# EAGLE design Nomi's_Smart_Socket_V1 (EAGLE 9.3.0)
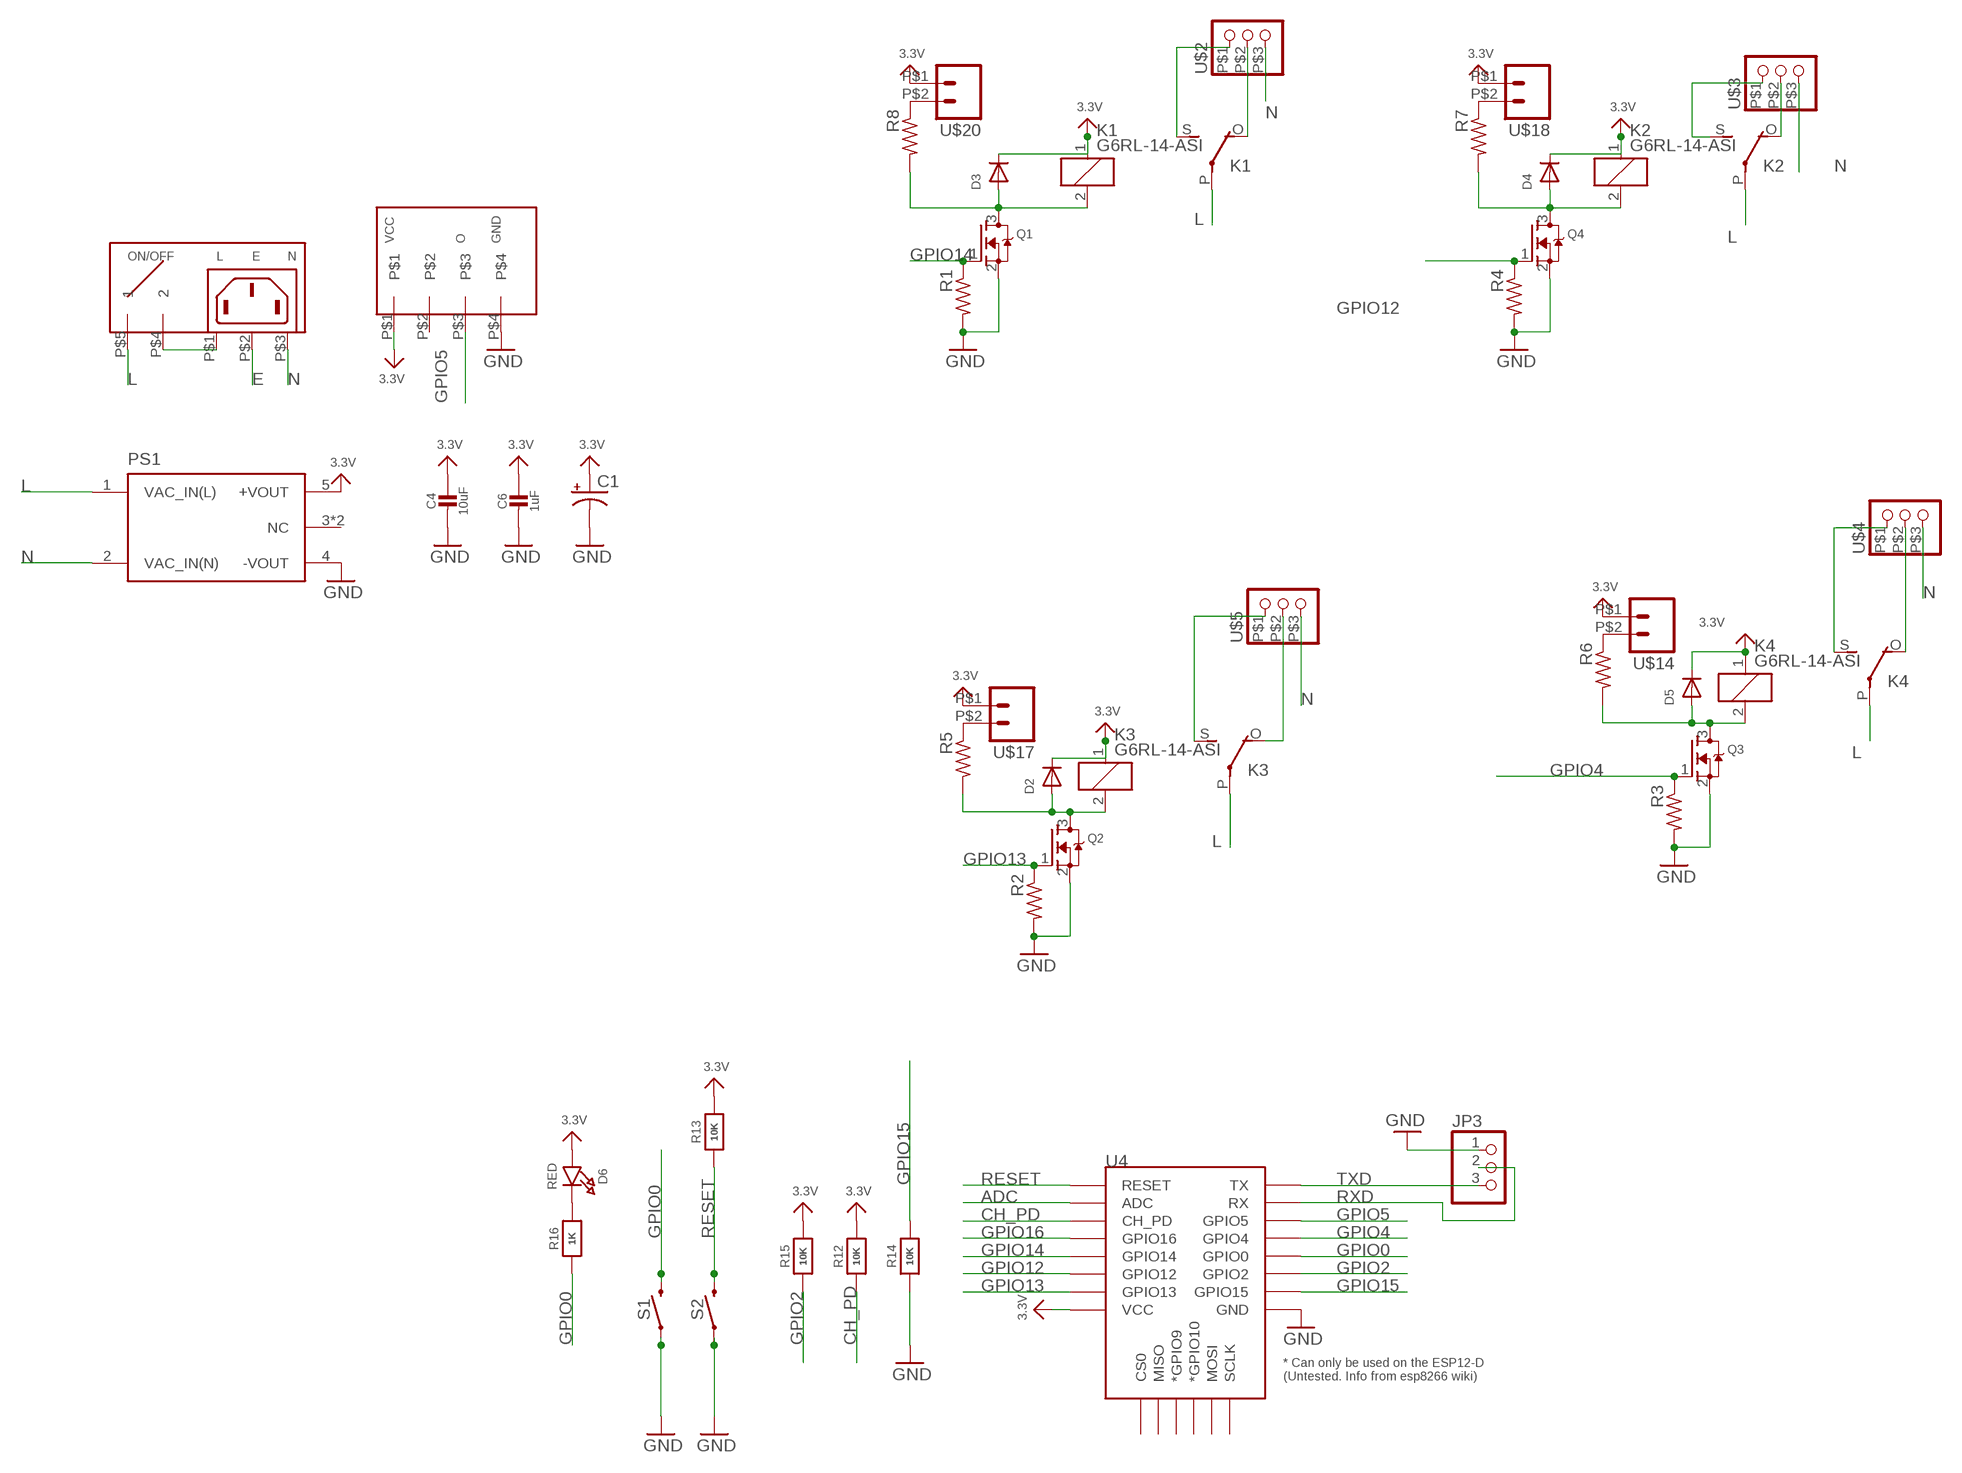
[diagram p0: schematic, sheet 1]

## Parts
C1  CPOL-USE5-10.5  [E5-10,5]
C4  10uF  CAP_CERAMIC_0805  [_0805]
C6  1uF  CAP_CERAMIC_0603  [_0603]
D2  DIODE_SOD-123FL  [SOD-123FL]
D3  DIODE_SOD-123FL  [SOD-123FL]
D4  DIODE_SOD-123FL  [SOD-123FL]
D5  DIODE_SOD-123FL  [SOD-123FL]
D6  RED  LED0805_NOOUTLINE  [CHIPLED_0805_NOOUTLINE]
JP3  PINHD-1X3  [1X03]
K1  G6RL-14-ASI  [G6RW]
K2  G6RL-14-ASI  [G6RW]
K3  G6RL-14-ASI  [G6RW]
K4  G6RL-14-ASI  [G6RW]
PS1  RAC04-3.3SGBRAC04-3.3SGB-3D  [DIP1778W80P508L3670H1500Q6B]
Q1  MOSFET-NREFLOW  [SOT23]
Q2  MOSFET-NREFLOW  [SOT23]
Q3  MOSFET-NREFLOW  [SOT23]
Q4  MOSFET-NREFLOW  [SOT23]
R1  10k  R-US_R0603  [R0603]
R2  10k  R-US_R0603  [R0603]
R3  10k  R-US_R0603  [R0603]
R4  10k  R-US_R0603  [R0603]
R5  22  R-US_R0603  [R0603]
R6  22  R-US_R0603  [R0603]
R7  22  R-US_R0603  [R0603]
R8  22  R-US_R0603  [R0603]
R12  10K  RESISTOR_0603  [_0603]
R13  10K  RESISTOR_0603  [_0603]
R14  10K  RESISTOR_0603  [_0603]
R15  10K  RESISTOR_0603  [_0603]
R16  1K  RESISTOR_0603  [_0603]
S1  MOMENTARY-SWITCH-SPST-SMD-4.6X2.8MM  [TACTILE_SWITCH_SMD_4.6X2.8MM]
S2  MOMENTARY-SWITCH-SPST-SMD-4.6X2.8MM  [TACTILE_SWITCH_SMD_4.6X2.8MM]
U4  ESP12FSMD  [ESP12F]
U$1  AC-CONN-WITH-SWITCH  [AC-CONN-WITH-SWITCH]
U$2  TERM-BLOCK-3POS-5MM5MM  [TERM-BLOCK-3POS-5MM]
U$3  TERM-BLOCK-3POS-5MM5MM  [TERM-BLOCK-3POS-5MM]
U$4  TERM-BLOCK-3POS-5MM5MM  [TERM-BLOCK-3POS-5MM]
U$5  TERM-BLOCK-3POS-5MM5MM  [TERM-BLOCK-3POS-5MM]
U$13  DHT22  [DHT22]
U$14  TERMINAL-BLOCK-2POS-2.54MM  [TERMINAL-BLOCK-2POS-2.54MM]
U$17  TERMINAL-BLOCK-2POS-2.54MM  [TERMINAL-BLOCK-2POS-2.54MM]
U$18  TERMINAL-BLOCK-2POS-2.54MM  [TERMINAL-BLOCK-2POS-2.54MM]
U$20  TERMINAL-BLOCK-2POS-2.54MM  [TERMINAL-BLOCK-2POS-2.54MM]

## Nets
3.3V: C1.+ C4.1 C6.1 D2.C D3.C D4.C D5.C D6.A K1.1 K2.1 K3.1 K4.1 PS1.5(+VOUT) R12.2 R13.2 R15.2 U4.3.3V(VCC) U$13.P$1 U$14.P$1 U$17.P$1 U$18.P$1 U$20.P$1
ADC: U4.ADC
CH_PD: R12.1 U4.EN(CH_PD)
E: U$1.P$2(EARTH)
GND: C1.- C4.2 C6.2 JP3.1 PS1.4(-VOUT) Q1.2(S) Q2.2(S) Q3.2(S) Q4.2(S) R1.2 R2.2 R3.2 R4.2 R14.1 S1.1 S1.2 S2.1 S2.2 U4.GND U$13.P$4
GPIO0: R16.1 S1.3 S1.4 U4.GPIO0
GPIO2: R15.1 U4.GPIO2
GPIO4: Q3.1(G) R3.1 U4.GPIO4
GPIO5: U4.GPIO5 U$13.P$3
GPIO12: Q4.1(G) R4.1 U4.GPIO12
GPIO13: Q2.1(G) R2.1 U4.GPIO13
GPIO14: Q1.1(G) R1.1 U4.GPIO14
GPIO15: R14.2 U4.GPIO15
GPIO16: U4.GPIO16
L: K1.P(2:P) K2.P(2:P) K3.P(2:P) K4.P(2:P) PS1.1(VAC_IN(L)) U$1.P$5
N: PS1.2(VAC_IN(N)) U$1.P$3(N) U$2.P$3 U$3.P$3 U$4.P$3 U$5.P$3
N$1: U$1.P$1(L) U$1.P$4
N$2: D5.A K4.2 Q3.3(D) R6.2
N$3: D2.A K3.2 Q2.3(D) R5.2
N$4: D3.A K1.2 Q1.3(D) R8.2
N$5: D6.C R16.2
N$6: D4.A K2.2 Q4.3(D) R7.2
N$7: K4.O(2:O) U$4.P$2
N$8: K2.O(2:O) U$3.P$2
N$9: R5.1 U$17.P$2
N$10: R6.1 U$14.P$2
N$11: R7.1 U$18.P$2
N$12: R8.1 U$20.P$2
N$13: K4.S(2:S) U$4.P$1
N$14: K3.O(2:O) U$5.P$2
N$15: K1.S(2:S) U$2.P$1
N$16: K1.O(2:O) U$2.P$2
N$17: K2.S(2:S) U$3.P$1
N$18: K3.S(2:S) U$5.P$1
RESET: R13.1 S2.3 S2.4 U4.RST(RESET)
RXD: JP3.2 U4.RXD(RX)
TXD: JP3.3 U4.TXD(TX)
Unconnected: PS1.3(NC) PS1.6(NC) U4.CLK(SCLK) U4.CS0 U4.GPIO9(*GPIO9) U4.GPIO10(*GPIO10) U4.MISO U4.MOSI U$13.P$2

## Library data of the parts
C1 = adafruit:CPOL-US: POLARIZED CAPACITOR, American symbol
C4 C6 = microbuilder:CAP_CERAMIC: Ceramic Capacitors For new designs, use the packages preceded by an '_' character since they are more reliable: The following footprints should be used on most boards: _0402 - Standard footprint for regular board layouts _0603 - Standard footprint for regular board layouts _0805 - Standard footprint for regular board layouts _1206 - Standard footprint for regular board layouts For extremely tight-pitch boards where space is at a premium, the following 'micro-pitch' footprints can be used (smaller pads, no silkscreen outline, etc.): _0402MP - Micro-pitch footprint for very dense/compact boards _0603MP - Micro-pitch footprint for very dense/compact boards _0805MP - Micro-pitch footprint for very dense/compact boards _1206MP - Micro-pitch footprint for very dense/compact boards
D2-D5 = adafruit:DIODE: Diode SMADIODE - SMA Surface Mount Package 20V 1A Schottky Diode Digikey: 641-1014-6-ND DO-1N4148 - Through Hole Small Current Diode SOD-123 20V 1 A (.5mV Vf) Schottky Diode - Digikey: MBRX120TPMSCT-ND SOD-323 10V 570mA (.38mV Vf, 3ns) Schottky Diode - Digikey: ZLLS410CT-ND SOD-523 30V 30mA Schottky Diode (RB751S-40TE61) - Digikey: RB751S-40TE61CT-ND SOT23-R/W - SOT23 Package (R = Solder Paste/Reflow Ovens, W = Hand-Soldering) BAT54Film 40V 300mA - Digikey: 497-7162-1-ND
D6 = microbuilder:LED: LED 0603 - 0603 Surface Mount Package 2mA: Green LED - Low Power (3.9mcd, 2ma, 1.7Vf) - Digikey: 475-2709-2-ND Orange LED - Low Power (9.8mcd, 2ma, 1.8Vf) - Digikey: 475-1194-2-ND Red LED - Low Power (5mcd, 2ma, 1.8Vf) - Digikey: 475-1195-2-ND Yellow LED - Low Power (7mcd, 2ma, 1.8Vf) - Digikey: 475-1196-2-ND 5mA: Blue LED - Low Power (17mcd, 5ma, 2.9Vf) - Digikey: LNJ937W8CRACT-ND 0805 - 0805 Surface Mount Package 2mA: Red LED (8.8mcd, 2mA, 1.8Vf, Clear) - Low Power [Digikey: 475-2510-1-ND] Green LED (5mcd, 2mA, 1.8Vf, Clear) - Low Power [Digikey: 475-2730-1-ND] Yellow LED (11.3mcd, 2mA, 1.8Vf, Clear) - Low Power [Digikey: 475-2555-1-ND] 20mA: Red LED (104mcd, 20mA, Diffused) - LS R976 [Digikey: 475-1278-6-ND] Red LED (12mcd, 20mA, 2.0Vf, Clear) - APT2012EC [Digikey: 754-1128-1-ND] Green LED (15mcd, 20mA, 2.2Vf, Clear) - APT2012GC [Digikey: 754-1131-1-ND] Orange LED (160mcd, 20mA, 2.1Vf, Clear) - APT2012SECK [Digikey: 754-1130-1-ND] 1206 - 1206 Surface Mount Package Green LED (26mcd, 20mA, Diffused) - LG N971 [Digikey: 475-1407-6-ND] Red LED (15mcd, 20mA, Diffused) - LH N974 [Digikey: 475-1416-6-ND] Cree - Cree High-Power Surface Mount LEDs XPEBWT-L1-0000-00D50 - White 111lm 350mA 2.9Vf 6200K 110° XTEAWT-00-0000-00000LEE3 - White 114lm 350mA 2.85Vf 5000K 115° Everlight - Everlight 45-21 Series Surface Mount LEDs 45-21/QK2C-B2832AC2CB2/2T - Warm White 2000mcd 20mA 3.25Vf 3050K 120° 45-21/LK2C-B38452C4CB2/2T - Nuetral White 2000mcd 20mA 3.25Vf 4150K 120° 45-21/LK2C-B50634C6CB2/2T - Cold White 2200mcd 20mA 3.25Vf 5650K 120° PLCC2 Reverse Mount LS T77K-J1L2-1-0-2-R18-Z - Red 11.25mcd 2mA 1.8Vf 630nm 120° LO T77K-L1M2-24-Z - Orange 19.6mcd 2mA 1.8Vf 606nm 120° LY T77K-K2M1-26-Z - Yellow 15.7mcd 2mA 1.8Vf 587nm 120°
JP3 = pinhead:PINHD-1X3: PIN HEADER
K1-K4 = LinkDesign:G6RL-14-ASI: RELAY 1 x switch, Omron; OC_FARNELL: unknown; OC_NEWARK: unknown
PS1 = LinkDesign:RAC04-3.3SGB: AC/DC Converter, 4 Watt, Single Output, EMC Class B
Q1-Q4 = adafruit:MOSFET-N: N-Channel Mosfet 2N7002E - 60V 260mA SOT23 [Digikey: 2N7002ET1GOSTR-ND] - REEL BSH103 - 30V 850mA SOT23 [Digikey: 568-5013-1-ND]
R1-R8 = adafruit:R-US_: RESISTOR, American symbol
R12-R16 = microbuilder:RESISTOR: Resistors For new designs, use the packages preceded by an '_' character since they are more reliable: The following footprints should be used on most boards: _0402 - Standard footprint for regular board layouts _0603 - Standard footprint for regular board layouts _0805 - Standard footprint for regular board layouts _1206 - Standard footprint for regular board layouts For extremely tight-pitch boards where space is at a premium, the following 'micro-pitch' footprints can be used (smaller pads, no silkscreen outline, etc.): _0402MP - Micro-pitch footprint for very dense/compact boards _0603MP - Micro-pitch footprint for very dense/compact boards _0805MP - Micro-pitch footprint for very dense/compact boards _1206MP - Micro-pitch footprint for very dense/compact boards
S1 S2 = SparkFun-Switches:MOMENTARY-SWITCH-SPST: Momentary Switch (Pushbutton) - SPST Normally-open (NO) SPST momentary switches (buttons, pushbuttons). Variants PTH-12MM - 12mm square, through-hole Momentary Pushbutton Switch - 12mm Square <https://www.sparkfun.com/products/9190> (COM-09190) PTH-6.0MM, PTH-6.0MM-KIT - 6.0mm square, through-hole Mini Pushbutton Switch <https://www.sparkfun.com/products/97> (COM-00097) KIT package intended for soldering kit's - only one side of pads' copper is exposed. PTH-RIGHT-ANGLE-KIT - Right-angle, through-hole Right Angle Tactile Button <https://www.sparkfun.com/products/10791> - Used on SparkFun BigTime Watch Kit <https://www.sparkfun.com/products/11734> SMD-12MM - 12mm square, surface-mount Tactile Button - SMD (12mm) <https://www.sparkfun.com/products/12993> (COM-12993) Used on SparkFun PicoBoard <https://www.sparkfun.com/products/11888> SMD-4.5MM - 4.5mm Square Trackball Switch Used on SparkFun Blackberry Trackballer Breakout <https://www.sparkfun.com/products/13169> SMD-4.6MMX2.8MM - 4.60mm x 2.80mm, surface mount Used on SparkFun SAMD21 Mini Breakout <https://www.sparkfun.com/products/13664> SMD-5.2MM, SMD-5.2-REDUNDANT - 5.2mm square, surface-mount Mini Pushbutton Switch - SMD <https://www.sparkfun.com/products/8720> (COM-08720) Used on Arduino Pro Mini <https://www.sparkfun.com/products/11114> REDUNDANT package connects both switch circuits together SMD-6.0X3.5MM - 6.0 x 3.5mm, surface mount Momentary Reset Switch SMD <https://www.sparkfun.com/products/8229> (COM-08229) SMD-6.2MM-TALL - 6.2mm square, surface mount Tactile Button - SMD (6mm) <https://www.sparkfun.com/products/12992> Used on SparkFun Digital Sandbox <https://www.sparkfun.com/products/12651> SMD-RIGHT-ANGLE - Right-angle, surface mount Used on SparkFun Block for Intel® Edison - Arduino <https://www.sparkfun.com/products/13036>; PROD_ID: SWCH-13065
U4 = noman:ESP12F: ESP12E Module
U$1 = LinkDesign:AC-CONN-WITH-SWITCH
U$2-U$5 = LinkDesign:TERM-BLOCK-3POS-5MM
U$13 = LinkDesign:DHT22
U$14 U$17 U$18 U$20 = LinkDesign:TERMINAL-BLOCK-2POS-2.54MM

## Board
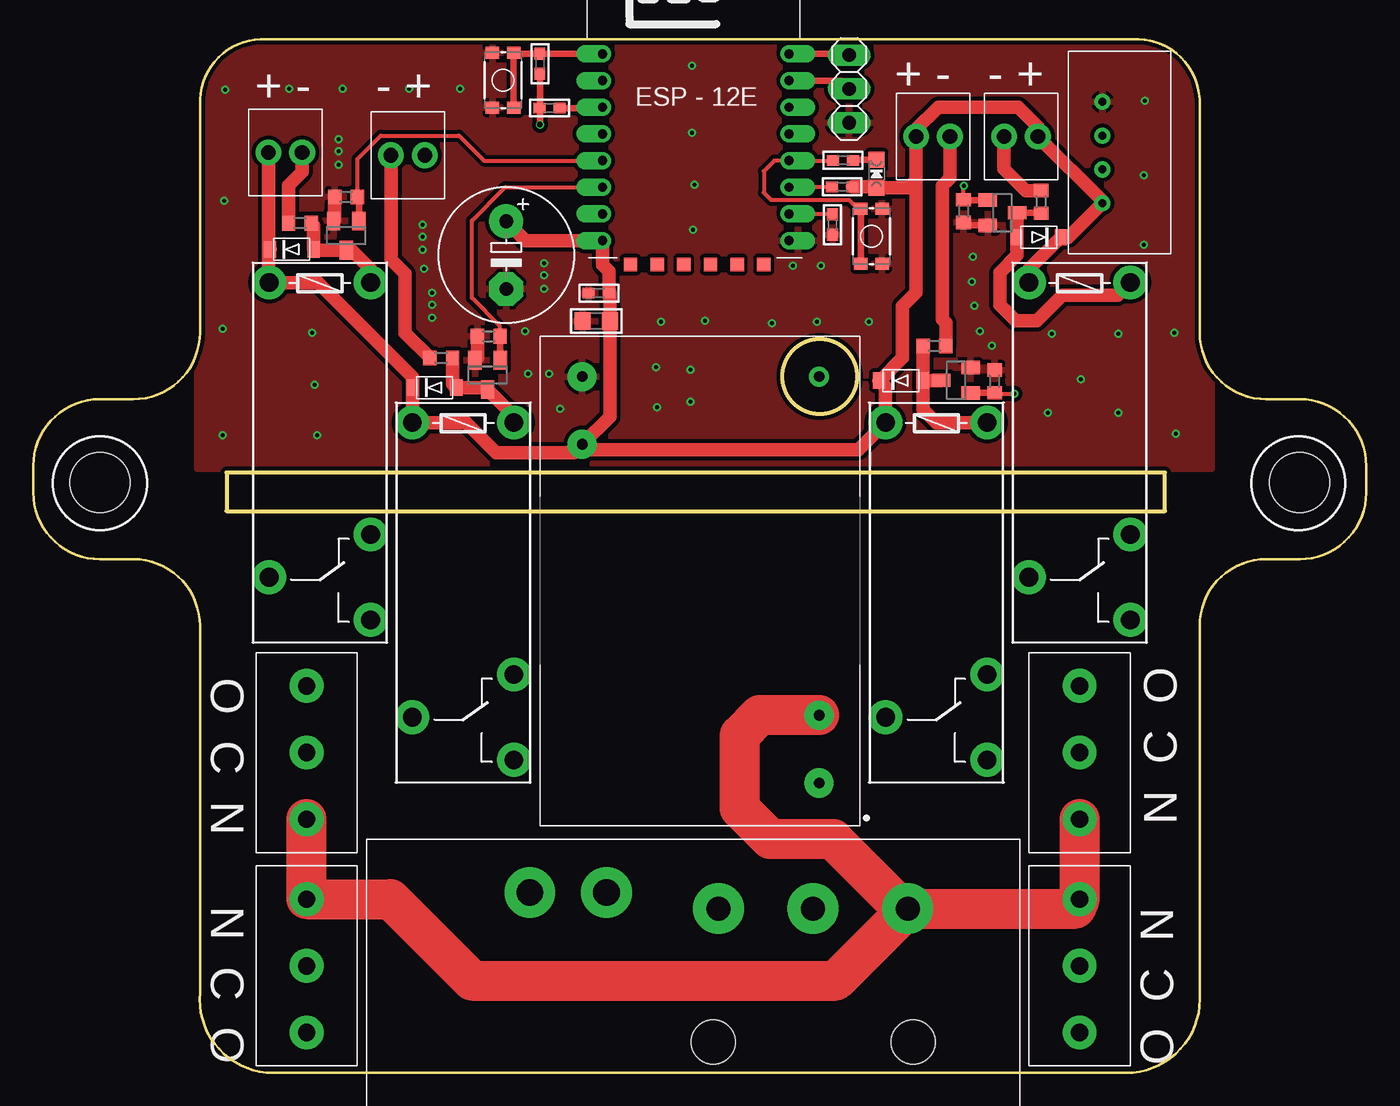
[diagram p1: board, top side]
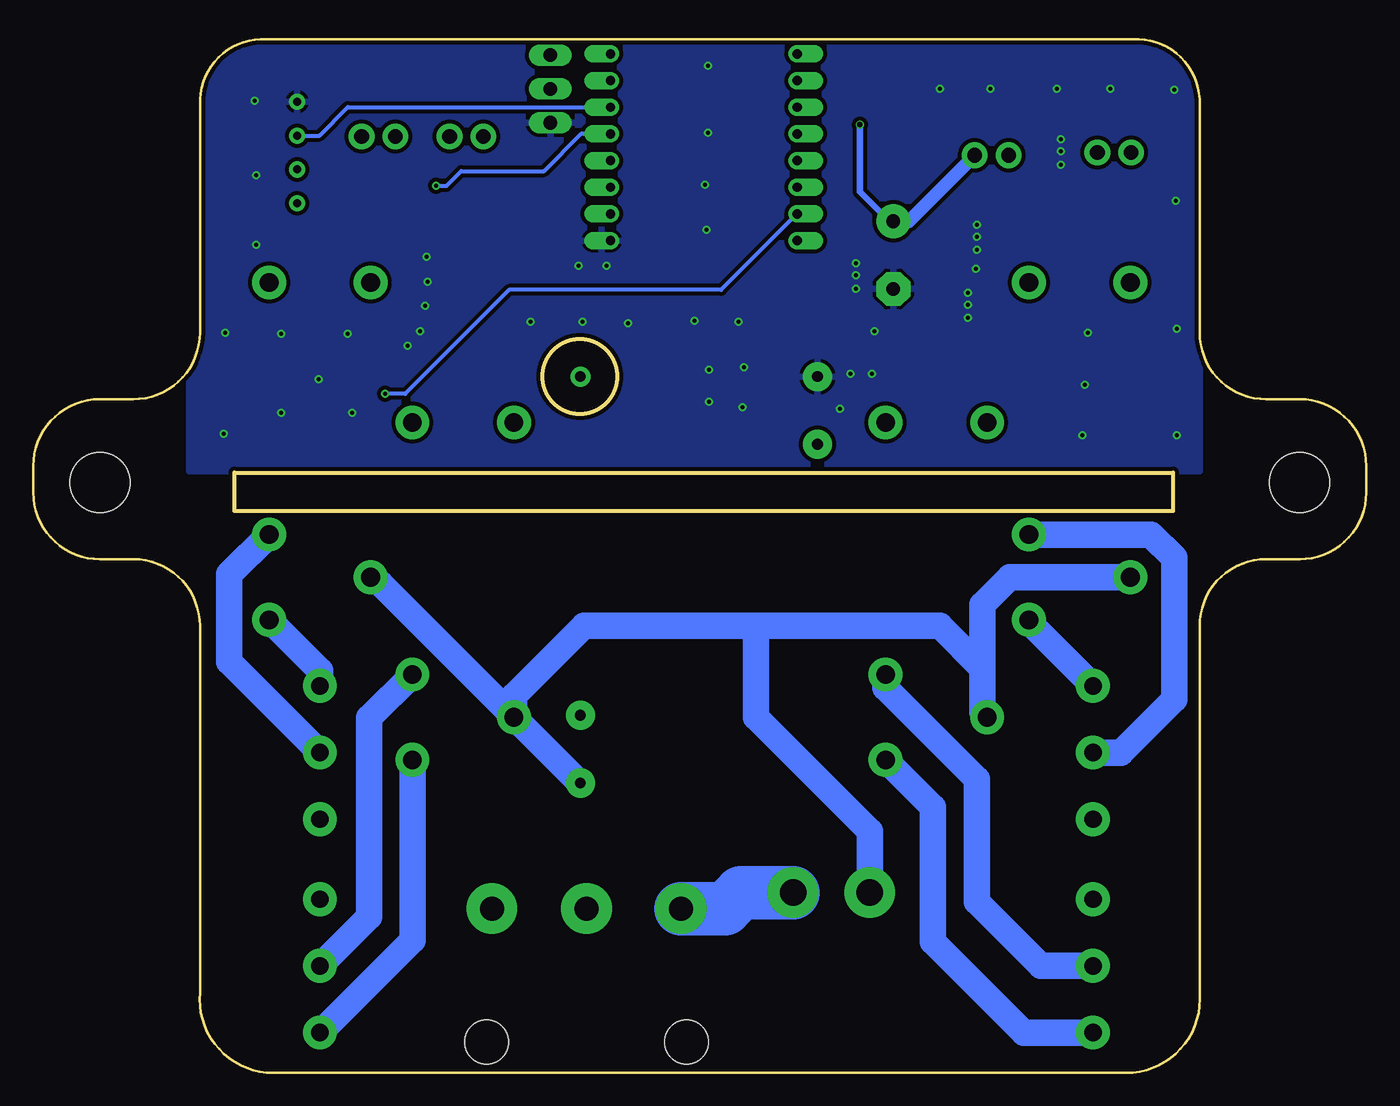
[diagram p2: board, bottom side, seen from below]

Size 100 x 77.5 mm. Coordinates in mm from the lower left corner, seen from the top.
Outline: 14.5,42.1 84.9,42.1 84.9,45 14.5,45 14.5,42.1
Outline: 87.5,33.5 87.5,6 arc-90 82.5,0 17.5,0 arc-90 12.5,6 12.5,33.5 arc90 7.5,38.5 5,38.5 arc-90 0,43.5 0,45.5 arc-90 5,50.5 7.5,50.5 arc90 12.5,55.5 12.5,73 arc-90 17.5,77.5 82.5,77.5 arc-90 87.5,73 87.5,55.5 arc90 92.5,50.5 95,50.5 arc-90 100,45.5 100,43.5 arc-90 95,38.5 92.5,38.5 arc90 87.5,33.5
Outline: circle at 59,52.2 radius 2.8
Copper layers (1*16): Top 0.035mm / dielectric 1.5mm / Bottom 0.035mm
Design rules "default *": minimum track width 8mil, minimum drill 0.3mm, track to track 6mil, track to pad 6mil, pad to pad 6mil, via to via 6mil, smd to smd 6mil, copper to edge 10mil, drill to drill 8mil, minimum pad ring 12mil, minimum via ring 1mil, stop-mask expansion 4mil, vias tented up to drill 15mil, thermal gap 10mil
Holes 4.5 mm at 5,44.25 95,44.25

### Footprints (pad centres in the part's own frame; a part is rotated, then mirrored left to right if it is on the bottom)
E5-10,5 = drill 1.016 pad 2.54: + -2.54,0 | drill 1.016 pad 2.54 octagon: - 2.54,0
_0805 = smd 1.2 x 1.3: 1 -1.016,0; 2 1.016,0
_0603 = smd 0.9 x 0.8: 1 -0.762,0; 2 0.762,0
SOD-123FL = smd 0.91 x 1.22: A 1.637,0; C -1.637,0
CHIPLED_0805_NOOUTLINE = smd 1.2 x 1.2: A 0,-1.05; C 0,1.05
1X03 = drill 1.016 long: 1 -2.54,0; 2 0,0; 3 2.54,0
G6RW = drill 1.4 pad 2.54: 1 -12.75,-3.81; 2 -12.75,3.81; O 6.15,3.81; P 9.35,-3.81; S 12.55,3.81
DIP1778W80P508L3670H1500Q6B = drill 0.8 pad 2.184: 1 -8.955,15.282; 2 -8.955,10.202; 4 8.825,-15.198; 5 8.825,-10.118 | drill 0.8 pad 1.5: 3 -8.955,-15.198; 6 -8.955,-15.198
SOT23 = smd 1 x 1.4: 1 -0.95,-1.1; 2 0.95,-1.1; 3 0,1.1
R0603 = smd 1 x 1.1: 1 -0.85,0; 2 0.85,0
TACTILE_SWITCH_SMD_4.6X2.8MM = smd 0.9 x 1: 1 -2.05,-0.8; 2 2.05,-0.8; 3 2.05,0.8; 4 -2.05,0.8
ESP12F = drill 0.7 pad 1.27 offset: 3.3V -7.05,-8.2; ADC -7.05,3.8; EN -7.05,1.8; GND 6.946,-8.2; GPIO0 6.946,-2.2; GPIO2 6.946,-4.2; GPIO4 6.946,-0.2; GPIO5 6.946,1.8; GPIO12 -7.05,-4.2; GPIO13 -7.05,-6.2; GPIO14 -7.05,-2.2; GPIO15 6.946,-6.2; GPIO16 -7.05,-0.2; RST -7.05,5.8; RXD 6.946,3.8; TXD 6.946,5.8 | smd 1 x 1: CLK 5.05,-10; CS0 -4.95,-10; GPIO9 -0.95,-10; GPIO10 1.05,-10; MISO -2.95,-10; MOSI 3.05,-10
AC-CONN-WITH-SWITCH = drill 1.8 pad 3.81: P$1 0.4,19.8; P$2 7.5,19.8; P$3 14.6,19.8 | drill 2 pad 3.81: P$4 -8,21; P$5 -13.75,21 | hole 3.3: 0,9.8; 15,9.8
TERM-BLOCK-3POS-5MM = drill 1.3 pad 2.54: P$1 -5,0; P$2 0,0; P$3 5,0
DHT22 = drill 0.6: P$1 -3.81,0; P$2 -1.27,0; P$3 1.27,0; P$4 3.81,0
TERMINAL-BLOCK-2POS-2.54MM = drill 1.1 pad 1.93: P$1 0,1.27; P$2 0,-1.27

### Placement (x,y rotation side)
C1  35.48,61.31 270 top
C4  42.23,56.36 180 top
C6  42.44,58.46 180 top
D2  65.1,51.9 0 top
D3  19.4,61.74 0 top
D4  30.1,51.37 0 top
D5  75.44,62.65 180 top
D6  63.27,67.39 0 top
JP3  61.21,73.78 90 top
K1  21.5,46.5 270 top
K2  32.25,36 270 top
K3  67.75,36 270 top
K4  78.5,46.5 270 top
PS1  50,37 180 top
Q1  23.48,62.77 180 top
Q2  69.22,51.92 90 top
Q3  72.7,64.48 270 top
Q4  34.08,52.32 180 top
R1  23.47,65.67 180 top
R2  72.12,51.83 90 top
R3  69.78,64.61 270 top
R4  34.17,55.22 180 top
R5  67.6,54.5 180 top
R6  75.6,65.3 270 top
R7  30.6,53.6 0 top
R8  20,63.7 0 top
R12  38.73,72.34 180 top
R13  38.01,75.66 270 top
R14  59.95,63.59 90 top
R15  60.69,66.42 0 top
R16  60.75,68.41 0 top
S1  62.88,62.72 90 top
S2  35.24,74.42 270 top
U4  49.75,70.6 0 top
U$1  51,-7.5 0 top
U$2  20.5,24 270 top
U$3  20.5,8 90 top
U$4  78.5,24 270 top
U$5  78.5,8 90 top
U$13  80.2,69 90 top
U$14  74.1,70.2 270 top
U$17  67.5,70.2 90 top
U$18  28.1,68.8 270 top
U$20  18.9,69 90 top

### Tracks (layer width: path | path; a pad name or v marks a point on that pad's centre or on a via)
3.3V  (via drill 0.4 pad 0.6)
  Top 0.5: R13.2 38.01,72.39 38,72.38 | 38,72.38 R12.2 | v38,71.1 38,72.38
  Top 1: PS1.5 43.25,49.19 C4.1 43.25,58.41 C6.1 43.2,60.1 42.7,60.6 U4.3.3V 36.92,62.4 C1.+ | PS1.5 41.59,46.7 61.89,46.7 K3.1 63.94,51.42 D2.C 63.5,51.9 65.2,53.6 65.2,57.47 66.23,58.5 66.23,66.93 | PS1.5 40.56,46.5 34.7,46.5 32.45,48.75 K2.1 28.44,49.3 | R15.2 63.19,66.42 D6.A 65.64,66.34 66.23,66.93 | 28.44,51.35 D4.C 28.46,49.32 28.44,49.3 | 28.44,51.35 28.44,49.3 | 17.66,61.64 D3.C 17.66,61.84 | 17.66,61.64 17.66,58.78 K1.1 21.35,59.25 28.44,52.16 28.44,51.35 | 17.66,61.84 17.66,68.97 U$20.P$1 | 17.66,61.84 17.66,61.64 | 66.23,66.93 U$17.P$1 66.23,70.73 67.9,72.4 73.9,72.4 75.37,70.93 U$14.P$1 80.2,65.37 U$13.P$1 77.66,62.65 D5.C 74.69,60.26 K4.1
  Bottom 0.5: C1.+ 35.8,63.85 35.8,63.87 38,66.07 v38,71.1
  Bottom 1: C1.+ 34.32,63.85 U$18.P$1
CH_PD
  Top 0.5: R12.1 42.64,72.34 U4.EN
GND  (via drill 0.3 pad 0.6)
  Top 0.5: R3.2 70.01,63.53 Q3.2
  Top 1: Q4.2 33.32,53.61 R4.2 | Q1.2 22.62,63.96 R1.2
  other vias: 23.2,73.8 37.1,52.4 38.7,52.4 39.5,49.8 21.3,47.8 14.2,47.8 14.2,55.8 14.3,65.4 14.4,73.7 19.2,73.8 49.4,75.5 49.4,70.5 49.6,66.6 49.5,63.2 59.1,60.5 49.3,52.7 49.3,50.3 46.7,52.9 46.8,49.9 20.9,55.5 76.4,55.4 81.4,55.4 76.1,49.5 81.4,49.5 83.4,72.9 83.3,67.3 83.3,62.1 85.7,47.9 85.6,55.5 38.3,58.8 38.3,60.7 38.3,59.8 28.2,73.8 32,73.8 22.9,68.1 22.9,70 22.9,69.1 29.9,56.6 29.9,58.5 29.9,57.6 29.2,61.7 29.2,63.6 29.2,62.7 57,60.5 47.1,56.3 50.4,56.4 55.4,56.2 58.8,56.3 62.7,56.3 70.5,61.2 70.4,59.3 70.6,57.5 71,55.6 71.9,54.5 78.6,52 21.1,51.6 36.9,55.6 29.3,60.3
  pour Top (isolate 0.3, rank 6): 12.3,79.2 12.3,45.3 88.4,45.3 88.4,79.2
  pour Bottom (isolate 0.3, rank 6): 88.3,78.9 88.3,45.1 12.5,45.1 12.5,78.9
GPIO0
  Top 0.3: 59.97,68.4 U4.GPIO0 55.6,68.4 54.8,67.6 54.8,66 55.36,65.44 61.17,65.44 62.1,64.52
  Top 0.5: 59.97,68.4 R16.1 | S1.3 62.1,64.52 S1.4
GPIO2
  Top 0.3: 56.72,66.42 R15.1
  Top 0.5: U4.GPIO2 56.72,66.42
GPIO4  (via drill 0.3 pad 0.6)
  Top 0.3: R3.1 69.78,66.48
  Top 0.5: Q3.1 70.21,65.43 70.01,65.23 R3.1 | v69.8,66.5 69.78,66.48
  Bottom 0.3: v69.8,66.5 69,66.5 67.9,67.6 61.7,67.6 58.9,70.4 58.7,70.4 U4.GPIO4
GPIO5
  Bottom 0.3: U4.GPIO5 76.4,72.4 78.53,70.27 U$13.P$3
GPIO12
  Top 0.3: U4.GPIO12 35.4,66.4 32.9,63.9 32.9,58.1 35.02,55.98 R4.1
  Top 0.5: R4.1 35.02,53.43 Q4.1
GPIO13  (via drill 0.3 pad 0.6)
  Top 0.3: 72.2,50.9 v73.6,50.9
  Top 0.5: Q2.1 R2.1 72.2,50.9
  Bottom 0.3: U4.GPIO13 48.4,58.7 64.3,58.7 72.1,50.9 v73.6,50.9
GPIO14
  Top 0.3: U4.GPIO14 33.8,68.4 31.93,70.27 26.07,70.27 24.32,68.52 R1.1
  Top 0.5: Q1.1 24.43,65.56 R1.1
GPIO15
  Top 0.3: R14.2 56.74,64.36
  Top 0.5: 56.74,64.36 U4.GPIO15
L
  Bottom 2: K3.P 73.94,36.65 K4.P | K2.P 28.8,27.01 28.8,30.3 | 28.8,30.3 28.8,35.1 26.75,37.15 K1.P | K3.P 63.94,28.26 58.7,33.5 45.8,33.5 | 28.8,30.3 32,33.5 45.8,33.5 | 45.8,33.5 45.8,26.65 37.25,18.1 U$1.P$5 | PS1.1 59.01,21.72 K3.P
N
  Top 3: U$1.P$3 78.2,12.3 U$5.P$3 U$4.P$3 | U$1.P$3 60.2,6.9 32.9,6.9 26.8,13 U$3.P$3 U$2.P$3 | PS1.2 54.5,26.8 53,25.3 53,19.8 55.3,17.5 60,17.5 65.2,12.3 U$1.P$3
N$1
  Bottom 4: U$1.P$4 46.9,13.5 48.1,12.3 U$1.P$1
N$2
  Top 0.5: Q3.3 75.57,64.48 R6.2
  Top 1: Q3.3 D5.A 73.81,61.31 72.5,60 72.5,57.6 73.7,56.4 75.3,56.4 77.2,58.3 81.36,58.3 K4.2
N$3
  Top 1: Q2.3 68.1,51.9 D2.A 66.75,51.92 | R5.2 66.75,51.92 | K3.2 67.75,48.75 66.75,49.75 66.75,51.92
N$4
  Top 1: R8.2 21.03,63.52 D3.A 21.1,61.67 Q1.3 23.88,61.67 25.31,60.24 K1.2
N$5
  Top 0.5: D6.C 61.54,68.44 R16.2
N$6
  Top 1: R7.2 31.45,51.65 D4.A 33.93,51.37 Q4.3 36.06,49.24 K2.2
N$7
  Bottom 2: U$4.P$2 85.3,30.8 85.3,37.36 K4.O
N$8
  Bottom 2: K2.O 36.06,28.86 29.2,22 29.2,12.8 24.4,8 U$3.P$2
N$9
  Top 1: U$17.P$2 68.77,67.07 68.2,66.5 68.2,56.5 68.45,56.25 R5.1
N$10
  Top 1: R6.1 74.45,66.15 72.83,67.77 U$14.P$2
N$11
  Top 1: R7.1 27.9,55.45 27.9,59.9 26.83,60.97 U$18.P$2
N$12
  Top 1: R8.1 19.15,66.55 20.17,67.57 U$20.P$2
N$13
  Bottom 2: K4.S 78.5,30.14 U$4.P$1
N$14
  Bottom 2: U$5.P$2 74.8,11.7 74.8,26.61 K3.O
N$15
  Bottom 2: U$2.P$1 25.31,33.81 K1.S
N$16
  Bottom 2: K1.O 16.15,40.35 14.4,38.6 14.4,28 18.4,24 U$2.P$2
N$17
  Bottom 2: K2.S 32.5,19.89 32.5,9.8 25.7,3 U$3.P$1
N$18
  Bottom 2: U$5.P$1 71.56,9.94 K3.S
RESET
  Top 0.5: U4.RST 42.68,76.42 R13.1 36.09,76.42 S2.4 S2.3
RXD
  Top 0.5: JP3.2 60.58,74.4 U4.RXD
TXD
  Top 0.5: U4.TXD 61.12,76.4 JP3.3

### Text on the board
tNames: + - | - + | + - | - + | O C N | N C O | N C O | O C N